# Altium schematic sheet FPC(Flexible Printed Circuit).SchDoc
size A4; SheetNumber: 6; SheetTotal: 6
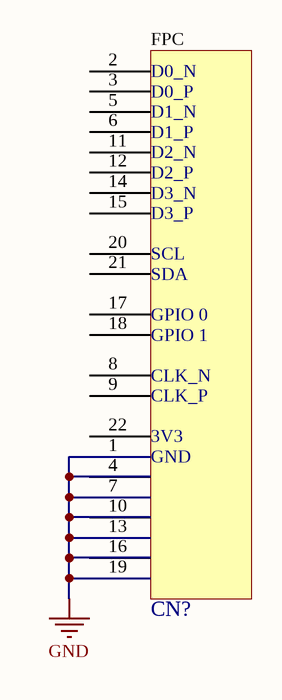
[diagram p0: FPC(Flexible Printed Circuit).SchDoc]

## Parts
CN?  FPC  [FPC-SMD_22P-P0.50_FH55-22S-0.5SH]

## Nets
GND: CN?.1(GND) CN?.4(GND) CN?.7(GND) CN?.10(GND) CN?.13(GND) CN?.16(GND) CN?.19(GND)

Not connected (* = marked no-connect by the designer): CN? 2(DATA_0_N) 3(DATA_0_P) 5(DATA_1_N) 6(DATA_1_P) 8(CLK_N) 9(CLK_P) 11(DATA_2_N) 12(DATA_2_P) 14(DATA_3_N) 15(DATA_3_P) 17(GPIO_0) 18(GPIO_1) 20(SCL) 21(SDA) 22(PWR)

## Notes on the sheet
- (in symbol FH55-22S-0.5SH) D0_N; D0_P; D1_N; D1_P; D2_N; D2_P; D3_N; D3_P; 3V3

## Library data of the parts
CN? = FH55-22S-0.5SH: Flip-Top -55â„ƒ~+85â„ƒ 22P 0.5mm 500mA 50V Gold Surface Mount, Right Angle Phosphor bronze SMD,P=0.5mm FFC, FPC (Flat Flexible) Connector Assemblies RoHS; Name: C5182313; Source: LCSC